# Altium schematic sheet SM3.SchDoc
size A
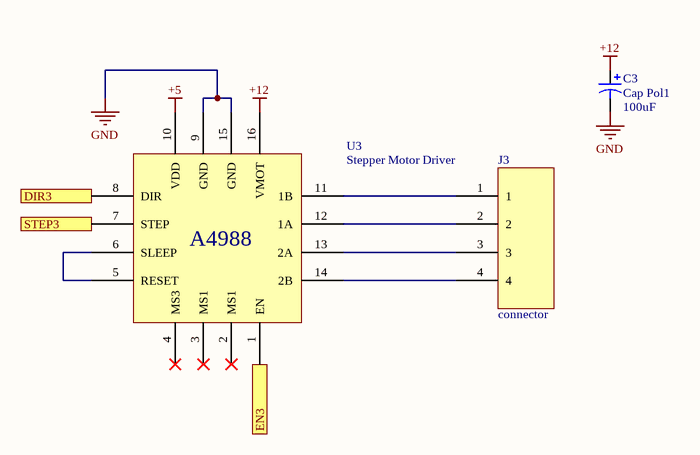
[diagram p0: SM3.SchDoc]

## Parts
C3  Cap Pol1  value 100uF  [RB7.6-15]
J3  connector
U3  Stepper Motor Driver

## Ports
DIR3, EN3, STEP3

## Nets
+5: U3.10(VDD)
+12: C3.1 U3.16(VMOT)
GND: C3.2 U3.9(GND) U3.15(GND)
DIR3: U3.8(DIR) ; port DIR3
EN3: U3.1(EN) ; port EN3
STEP3: U3.7(STEP) ; port STEP3
NetJ3_1: J3.1 U3.11(1B)
NetJ3_2: J3.2 U3.12(1A)
NetJ3_3: J3.3 U3.13(2A)
NetJ3_4: J3.4 U3.14(2B)
NetU3_5: U3.5(RESET) U3.6(SLEEP)

Not connected (* = marked no-connect by the designer): U3 2(MS1)* 3(MS1)* 4(MS3)*

## Library data of the parts
C3 = Cap Pol1: Polarized Capacitor (Radial); Published: 8-Jun-2000; LatestRevisionDate: 17-Jul-2002; LatestRevisionNote: Re-released for DXP Platform.; PackageReference: RB7.6-15; Publisher: Altium Limited; PackageDescription: Polarized Capacitor (Radial); 2 Leads
J3 = JST_4P
U3 = A4988